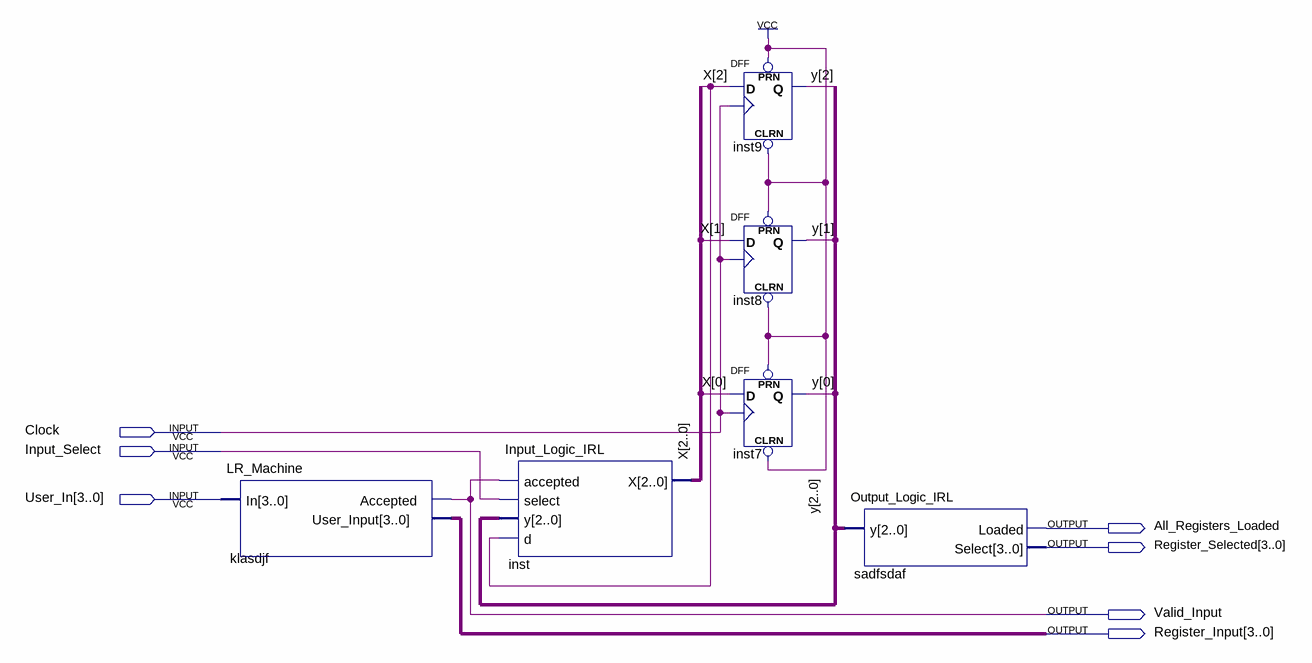
[diagram p0: schematic sheet]
// Quartus schematic IRL_Machine.bdf as structural Verilog: 6 symbols, 7 pins
module IRL_Machine (
  input  Clock,
  input  Input_Select,
  input  [3:0] User_In,
  output All_Registers_Loaded,
  output [3:0] Register_Selected,
  output Valid_Input,
  output [3:0] Register_Input
);

  wire [2:0] X, y;

  LR_Machine klasdjf (.In(User_In), .Accepted(Valid_Input), .User_Input(Register_Input));
  Input_Logic_IRL inst (.accepted(Valid_Input), .select(Input_Select), .y(y), .d(X[2]), .X(X));
  DFF inst9 (.CLRN(1'b1), .CLK(Clock), .D(X[2]), .PRN(1'b1), .Q(y[2]));
  DFF inst8 (.CLRN(1'b1), .CLK(Clock), .D(X[1]), .PRN(1'b1), .Q(y[1]));
  DFF inst7 (.CLRN(1'b1), .CLK(Clock), .D(X[0]), .PRN(1'b1), .Q(y[0]));
  Output_Logic_IRL sadfsdaf (.y(y), .Loaded(All_Registers_Loaded), .Select(Register_Selected));
endmodule
